# EAGLE design ME433_Collins (EAGLE 5.12)
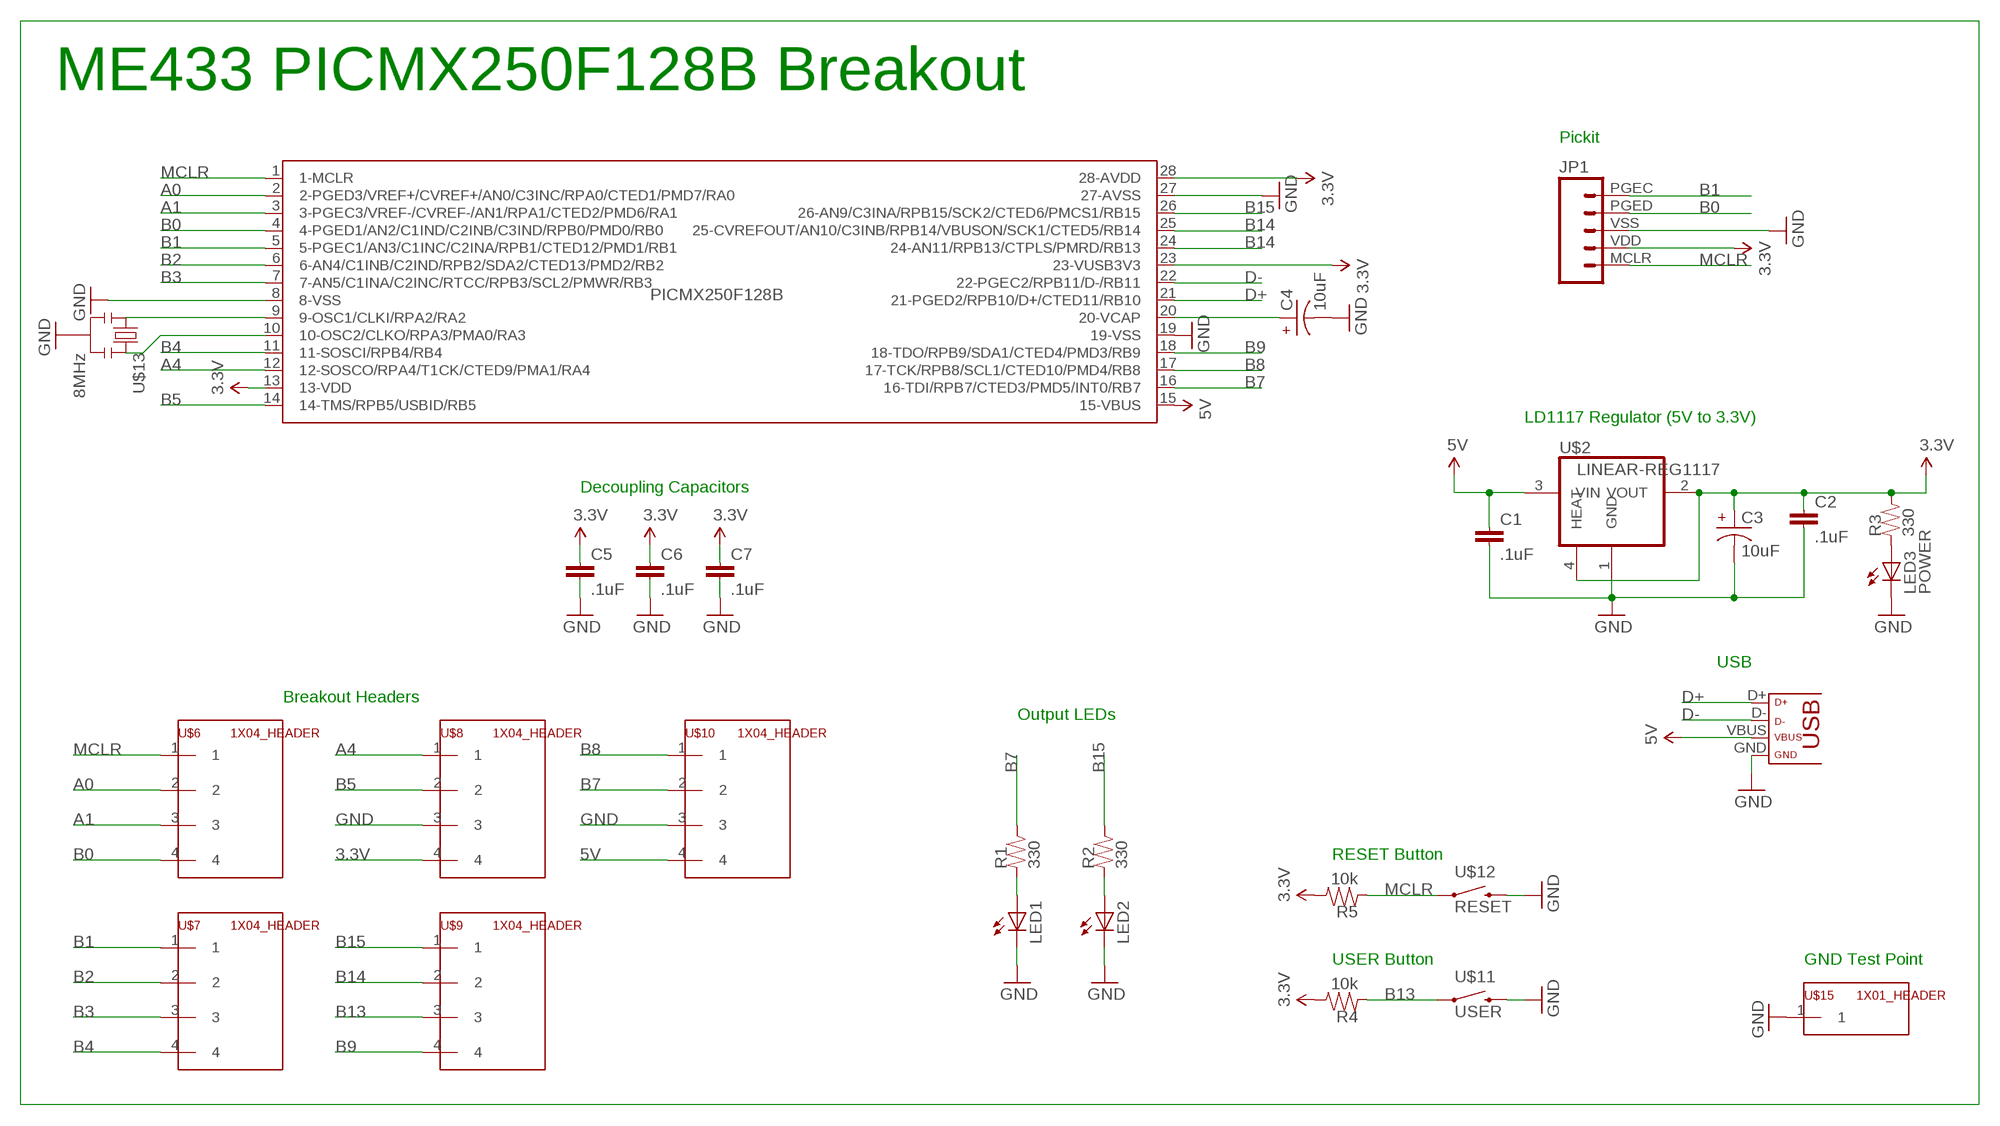
[diagram p0: schematic, sheet 1]

## Parts
C1  .1uF  CAP0603  [0603]
C2  .1uF  CAP0603  [0603]
C3  10uF  CAP-POL0603  [0603-POL]
C4  10uF  CAP-POL0603  [0603-POL]
C5  .1uF  CAP0603  [0603]
C6  .1uF  CAP0603  [0603]
C7  .1uF  CAP0603  [0603]
JP1  M05PICKIT3  [1X05-PICKIT3]
LED1  LED0603  [0603-DIODE]
LED2  LED0603  [0603-DIODE]
LED3  POWER  LED0603  [0603-DIODE]
R1  330  R0603  [0603]
R2  330  R0603  [0603]
R3  330  R0603  [0603]
R4  10k  R0603  [0603]
R5  10k  R0603  [0603]
U$1  PICMX250F128B  [DIL28-3]
U$2  LINEAR-REG1117  [SOT223]
U$4  USB  [USB-MINIB]
U$6  1X04_HEADER  [1X04]
U$7  1X04_HEADER  [1X04]
U$8  1X04_HEADER  [1X04]
U$9  1X04_HEADER  [1X04]
U$10  1X04_HEADER  [1X04]
U$11  USER  TACTILE_SWITCHPUSH  [PUSH_BUTTON]
U$12  RESET  TACTILE_SWITCHPUSH  [PUSH_BUTTON]
U$13  8MHz  RESONATOR  [RADIAL-3LEAD]
U$15  1X01_HEADER  [1X01]

## Nets
3.3V: C2.1 C3.+ C5.1 C6.1 C7.1 JP1.VDD R3.2 R4.2 R5.2 U$1.13(13-VDD) U$1.23(23-VUSB3V3) U$1.28(28-AVDD) U$2.2(VOUT) U$2.4(HEAT) U$8.4
5V: C1.1 U$1.15(15-VBUS) U$2.3(VIN) U$4.VBUS U$10.4
A0: U$1.2(2-PGED3/VREF+/CVREF+/AN0/C3INC/RPA0/CTED1/PMD7/RA0) U$6.2
A1: U$1.3(3-PGEC3/VREF-/CVREF-/AN1/RPA1/CTED2/PMD6/RA1) U$6.3
A4: U$1.12(12-SOSCO/RPA4/T1CK/CTED9/PMA1/RA4) U$8.1
B0: JP1.PGED U$1.4(4-PGED1/AN2/C1IND/C2INB/C3IND/RPB0/PMD0/RB0) U$6.4
B1: JP1.PGEC U$1.5(5-PGEC1/AN3/C1INC/C2INA/RPB1/CTED12/PMD1/RB1) U$7.1
B2: U$1.6(6-AN4/C1INB/C2IND/RPB2/SDA2/CTED13/PMD2/RB2) U$7.2
B3: U$1.7(7-AN5/C1INA/C2INC/RTCC/RPB3/SCL2/PMWR/RB3) U$7.3
B4: U$1.11(11-SOSCI/RPB4/RB4) U$7.4
B5: U$1.14(14-TMS/RPB5/USBID/RB5) U$8.2
B7: R1.2 U$1.16(16-TDI/RPB7/CTED3/PMD5/INT0/RB7) U$10.2
B8: U$1.17(17-TCK/RPB8/SCL1/CTED10/PMD4/RB8) U$10.1
B9: U$1.18(18-TDO/RPB9/SDA1/CTED4/PMD3/RB9) U$9.4
B13: R4.1 U$1.24(24-AN11/RPB13/CTPLS/PMRD/RB13) U$9.3 U$11.1
B14: U$1.25(25-CVREFOUT/AN10/C3INB/RPB14/VBUSON/SCK1/CTED5/RB14) U$9.2
B15: R2.2 U$1.26(26-AN9/C3INA/RPB15/SCK2/CTED6/PMCS1/RB15) U$9.1
D+: U$1.21(21-PGED2/RPB10/D+/CTED11/RB10) U$4.D+
D-: U$1.22(22-PGEC2/RPB11/D-/RB11) U$4.D-
GND: C1.2 C2.2 C3.- C4.- C5.2 C6.2 C7.2 JP1.VSS LED1.CAT(C) LED2.CAT(C) LED3.CAT(C) U$1.8(8-VSS) U$1.19(19-VSS) U$1.27(27-AVSS) U$2.1(GND) U$4.GND U$8.3 U$10.3 U$11.2 U$12.2 U$13.GND U$15.1
MCLR: JP1.MCLR R5.1 U$1.1(1-MCLR) U$6.1 U$12.1
N$2: LED1.AN(A) R1.1
N$3: U$1.10(10-OSC2/CLKO/RPA3/PMA0/RA3) U$13.2
N$4: U$1.9(9-OSC1/CLKI/RPA2/RA2) U$13.1
N$5: C4.+ U$1.20(20-VCAP)
N$6: LED2.AN(A) R2.1
N$8: LED3.AN(A) R3.1

## Notes on the sheet
- ME433 PICMX250F128B Breakout
- Pickit
- LD1117 Regulator (5V to 3.3V)
- Decoupling Capacitors
- USB
- Breakout Headers
- Output LEDs
- RESET Button
- USER Button | GND Test Point

## Library data of the parts
C1 C2 C5-C7 = ME433_MC:CAP: Capacitor Standard 0603 ceramic capacitor, and 0.1" leaded capacitor.
C3 C4 = ME433_MC:CAP-POL: CAPACITOR, American symbol
JP1 = ME433_MC:M05: Header 5 Standard 5-pin 0.1" header. Use with straight break away headers (SKU : PRT-00116), right angle break away headers (PRT-00553), swiss pins (PRT-00743), machine pins (PRT-00117), and female headers (PRT-00115). Molex polarized connector foot print use with SKU : PRT-08230 with associated crimp pins and housings.
LED1-LED3 = ME433_MC:LED: LEDs Standard schematic elements and footprints for 5mm, 3mm, 1206, and 0603 sized LEDs. 5mm - Spark Fun Electronics SKU : COM-00529 (and others)
R1-R5 = ME433_MC:R: RESISTOR, American symbol
U$1 = ME433_MC:PICMX250F128B
U$2 = ME433_MC:LINEAR-REG
U$4 = ME433_MC:USB
U$6-U$10 = ME433_MC:1X04_HEADER
U$11 U$12 = ME433_MC:TACTILE_SWITCH
U$13 = ME433_MC:RESONATOR
U$15 = ME433_MC:1X01_HEADER

## Board
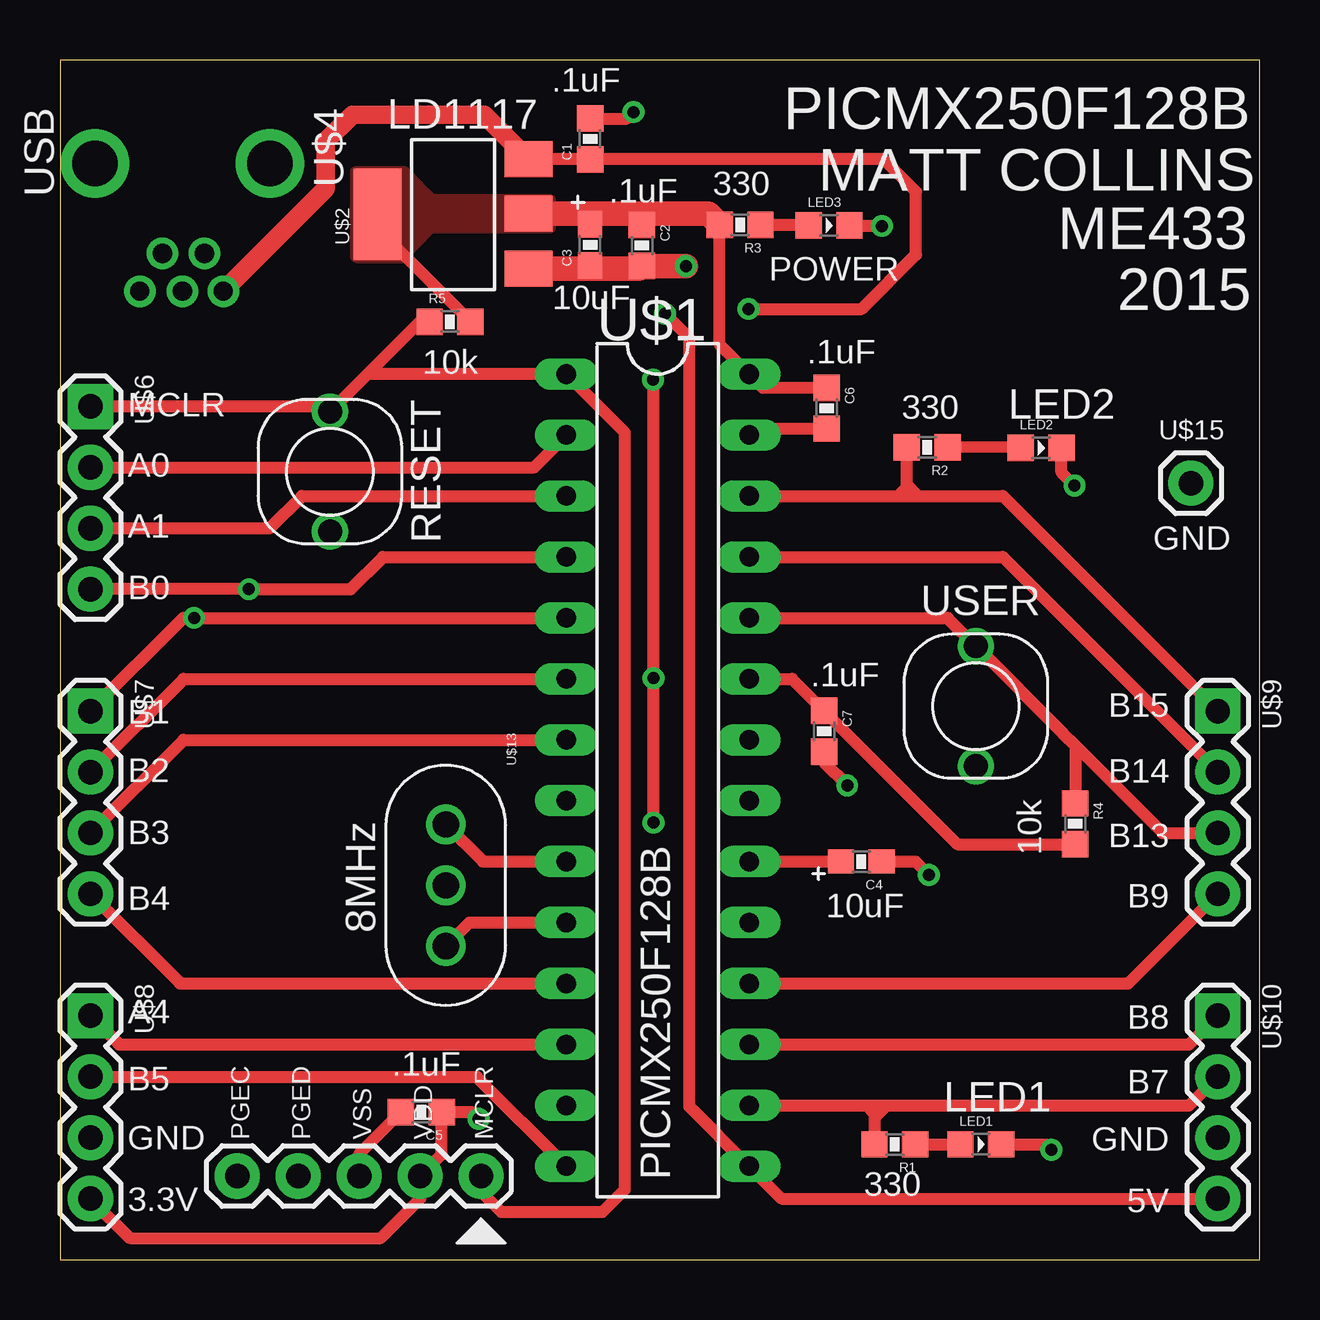
[diagram p1: board, top side]
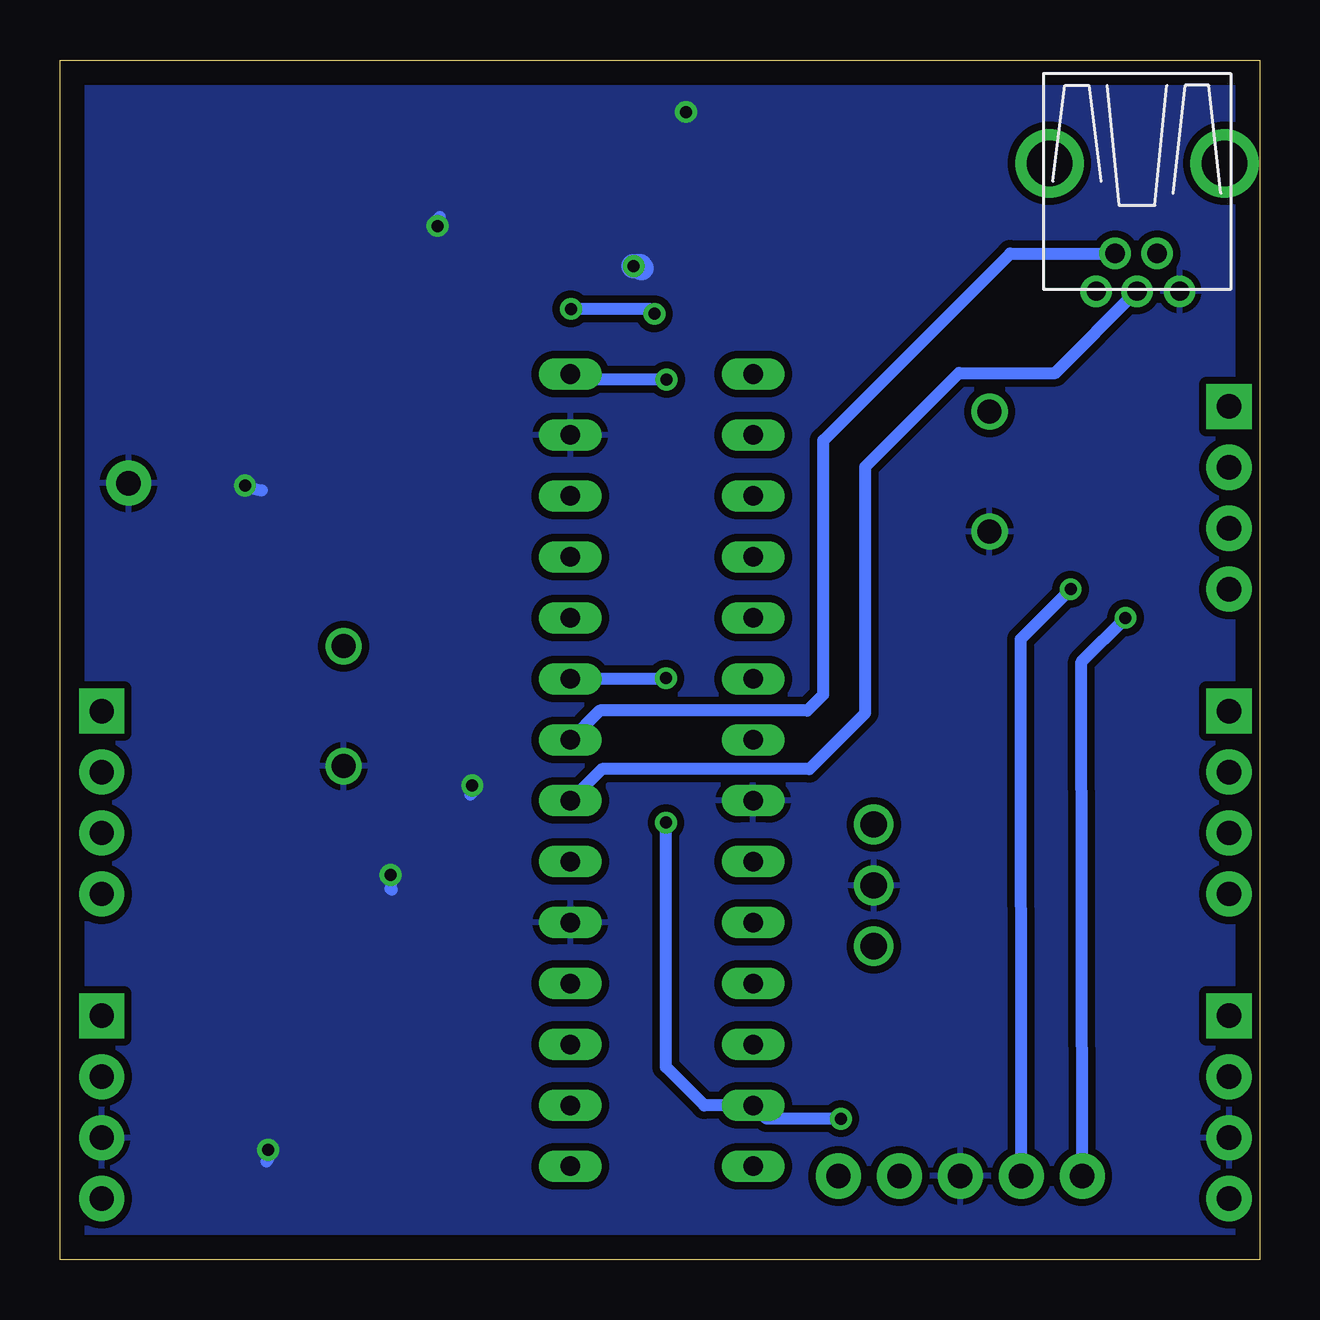
[diagram p2: board, bottom side, seen from below]

Size 50 x 50 mm. Coordinates in mm from the lower left corner, seen from the top.
Outline: 0,0 50,0 50,50 0,50 0,0
Copper layers (1*16): Top 0.035mm / dielectric 1.5mm / Bottom 0.035mm
Design rules "default": minimum track width 10mil, minimum drill 24mil, track to track 8mil, track to pad 8mil, pad to pad 8mil, via to via 8mil, smd to smd 8mil, copper to edge 40mil, drill to drill 8mil, minimum pad ring 10mil, minimum via ring 8mil, stop-mask expansion 4mil, vias tented up to drill 0mil, thermal gap 10mil

### Footprints (pad centres in the part's own frame; a part is rotated, then mirrored left to right if it is on the bottom)
0603 = smd 1.1 x 1.1: 1 -0.85,0; 2 0.85,0
0603-POL = smd 1.1 x 1: + 0.85,0; - -0.85,0
1X05-PICKIT3 = drill 1.016 pad 1.88 round: MCLR 1.27,-1.016; PGEC 11.43,-1.016; PGED 8.89,-1.016; VDD 3.81,-1.016; VSS 6.35,-1.016
0603-DIODE = smd 1.1 x 1.1: AN -0.85,0; CAT 0.85,0
DIL28-3 = drill 0.813 long: 1 -16.51,-3.81; 2 -13.97,-3.81; 3 -11.43,-3.81; 4 -8.89,-3.81; 5 -6.35,-3.81; 6 -3.81,-3.81; 7 -1.27,-3.81; 8 1.27,-3.81; 9 3.81,-3.81; 10 6.35,-3.81; 11 8.89,-3.81; 12 11.43,-3.81; 13 13.97,-3.81; 14 16.51,-3.81; 15 16.51,3.81; 16 13.97,3.81; 17 11.43,3.81; 18 8.89,3.81; 19 6.35,3.81; 20 3.81,3.81; 21 1.27,3.81; 22 -1.27,3.81; 23 -3.81,3.81; 24 -6.35,3.81; 25 -8.89,3.81; 26 -11.43,3.81; 27 -13.97,3.81; 28 -16.51,3.81
SOT223 = smd 1.499 x 2.007: 1 -2.261,-3.15; 2 0.025,-3.15; 3 2.311,-3.15 | smd 3.81 x 2.007: 4 0,3.15
USB-MINIB = drill 0.8 round: D+ 4.064,0; D- 2.489,0.914; GND 4.064,-1.778; ID 2.489,-0.838; VBUS 4.064,1.702 | drill 1.9 round: P$6 -1.27,-3.65; P$7 -1.27,3.65
1X04 = drill 1.016 pad 1.88 square: 1 0,0 | drill 1.016 pad 1.88 round: 2 2.54,0; 3 5.08,0; 4 7.62,0
PUSH_BUTTON = drill 1 round: 1 -2.5,0; 2 2.5,0
RADIAL-3LEAD = drill 1.1 round: 1 -2.54,0; 2 2.54,0; GND 0,0
1X01 = drill 1.016 pad 1.88 round: 1 0,0

### Placement (x,y rotation side)
C1  22.1,46.71 90 top
C2  24.26,42.27 270 top
C3  22.1,42.29 90 top
C4  33.4,16.59 180 top
C5  15.06,6.15 180 top
C6  31.95,35.48 270 top
C7  31.85,22.02 270 top
JP1  18.82,2.46 180 top
LED1  38.38,4.8 0 top
LED2  40.89,33.83 0 top
LED3  32.05,43.1 0 top
R1  34.8,4.8 180 top
R2  36.14,33.86 180 top
R3  28.35,43.13 180 top
R4  42.32,18.16 270 top
R5  16.26,39.09 0 top
U$1  24.92,20.4 270 top
U$2  16.38,43.56 90 top
U$4  5.11,44.42 270 top
U$6  1.27,35.56 270 top
U$7  1.27,22.86 270 top
U$8  1.27,10.16 270 top
U$9  48.26,22.86 270 top
U$10  48.26,10.16 270 top
U$11  38.18,23.06 270 top
U$12  11.25,32.84 270 top
U$13  16.08,15.6 270 top
U$15  47.14,32.36 0 top

### Tracks (layer width: path | path; a pad name or v marks a point on that pad's centre or on a via)
3.3V  (via drill 0.5)
  Top 0.508: U$8.4 2.92,0.89 13.36,0.89 15.01,2.54 JP1.VDD 15.91,4.38 C5.1 17.17,6.15 v17.45,5.87 | R3.2 27.5,38.14 U$1.28 29.3,36.33 C6.1 | R4.2 37.41,17.31 C7.1 30.52,24.21 U$1.23 | R5.2 13.23,42.96 U$2.4 | v24.74,18.21 v24.74,24.23 24.74,36.65 v24.71,36.68
  Top 1.016: 21.92,43.59 U$2.2 | 24.28,43.59 21.92,43.59 | 24.28,43.59 27.04,43.59 R3.2 | C3.+ 22.1,43.41 21.92,43.59 | C2.1 24.26,43.56 24.28,43.59
  Bottom 0.508: v24.74,18.21 24.74,8.03 23.14,6.43 U$1.13 20.55,5.87 v17.45,5.87 | v24.71,36.68 28.5,36.68 U$1.28 | U$1.23 24.77,24.21 v24.74,24.23
  pour Top (no thermals): 13,41.66 14.27,41.66 14.91,42.29 15.52,42.9 19.53,42.9 20.42,42.9 arc90 20.55,43.03 20.55,44.15 arc90 20.42,44.27 15.57,44.27 15.01,44.83 14.4,45.44 13,45.44 12.34,45.44 arc90 12.19,45.29 12.19,41.88 arc90 12.42,41.66
5V  (via drill 0.5)
  Top 0.508: U$2.3 22.09,45.87 C1.1 34.33,45.86 35.69,44.5 35.69,41.88 33.43,39.62 v28.7,39.62 | U$10.4 30.07,2.54 U$1.15 26.24,6.38 26.24,38.41 v25.22,39.42
  Top 0.762: U$4.VBUS 11.07,44.63 11.07,46.61 12.19,47.73 17.68,47.73 U$2.3
  Bottom 0.508: v28.7,39.62 25.43,39.62 v25.22,39.42
A0
  Top 0.508: U$1.2 19.76,33.02 U$6.2
A1
  Top 0.508: U$1.3 10.08,31.83 8.74,30.48 U$6.3
A4
  Top 0.508: U$1.12 2.46,8.97 U$8.1
B0  (via drill 0.5)
  Top 0.508: U$1.4 13.46,29.29 12.12,27.94 v7.87,27.94 U$6.4
  Bottom 0.508: JP1.PGED 9.96,25.86 v7.87,27.94
B1  (via drill 0.5)
  Top 0.508: U$1.5 v5.59,26.75 5.16,26.75 U$7.1
  Bottom 0.508: JP1.PGEC 7.42,24.92 v5.59,26.75
B2
  Top 0.508: U$1.6 5.16,24.21 U$7.2
B3
  Top 0.508: U$1.7 5.16,21.67 U$7.3
B4
  Top 0.508: U$1.11 5,11.51 U$7.4
B5
  Top 0.508: U$1.14 17.37,7.62 U$8.2
B7
  Top 0.508: U$1.16 33.6,6.43 | 33.6,6.43 34.47,6.43 | 34.47,6.43 47.07,6.43 U$10.2 | 34.47,6.43 33.95,5.91 | R1.2 33.95,6.08 33.6,6.43
B8
  Top 0.508: U$1.17 47.07,8.97 U$10.1
B9
  Top 0.508: U$1.18 44.53,11.51 U$9.4
B13
  Top 0.508: U$1.24 36.99,26.75 U$11.1 41.79,21.95 42.32,21.42 | 42.32,21.42 45.96,17.78 U$9.3 | 42.32,21.42 R4.1
B14
  Top 0.508: U$1.25 39.29,29.29 U$9.2
B15
  Top 0.508: U$1.26 34.92,31.83 | 34.92,31.83 35.76,31.83 | 35.76,31.83 39.29,31.83 U$9.1 | 34.92,31.83 35.29,32.2 | R2.2 35.29,32.3 35.76,31.83
D+
  Bottom 0.508: U$1.21 27.41,20.45 18.77,20.45 16.43,22.78 16.43,33.05 12.52,36.96 8.51,36.96 U$4.D+
D-
  Bottom 0.508: U$1.22 27.51,22.89 18.85,22.89 18.19,23.55 18.19,34.14 10.39,41.94 U$4.D-
GND  (via drill 0.5)
  Top 0.508: LED3.CAT 34.24,43.1 v34.27,43.08 | C1.2 23.63,47.56 v23.9,47.83 | C6.2 29,34.63 U$1.27 | LED1.CAT 41.1,4.8 v41.33,4.57 | LED2.CAT 41.74,32.8 v42.29,32.26 | C4.- 35.66,16.59 v36.22,16.03 | C7.2 31.85,20.73 v32.82,19.76 | C5.2 12.47,4.41 JP1.VSS
  Top 1.016: U$2.1 22.35,41.3 | 22.35,41.3 24.14,41.3 C2.2 26.07,41.42 v26.09,41.4 | C3.- 22.21,41.44 22.35,41.3
  Bottom 0.508: v34.27,43.08 34.27,43.36 34.16,43.46 | v23.9,47.83 23.82,47.75 | v41.33,4.57 41.33,4.17 41.4,4.09 | v42.29,32.26 42.47,32.26 41.58,32.05 | v36.22,16.03 36.22,15.47 36.17,15.42 | v32.82,19.76 32.82,19.46 32.89,19.38
  Bottom 1.016: v26.09,41.4 25.83,41.4 25.76,41.33
  pour Bottom (isolate 0.305): 24.13,49.53 49.53,49.53 49.53,30.48 49.53,0.38 12.67,0.38 0.23,0.38 0.23,35.64 0.23,49.53 23.88,49.53
MCLR
  Top 0.508: U$12.1 12.82,36.91 U$1.1 23.55,34.47 23.55,2.92 22.61,1.98 18.39,1.98 17.55,2.82 JP1.MCLR | U$6.1 11.03,35.56 U$12.1 | U$12.1 15,39.09 R5.1
N$2
  Top 0.508: R1.1 LED1.AN
N$3
  Top 0.508: U$1.10 17.07,14.05 U$13.2
N$4
  Top 0.508: U$1.9 17.63,16.59 U$13.1
N$5
  Top 0.508: U$1.20 C4.+
N$6
  Top 0.508: R2.1 39.99,33.88 LED2.AN
N$8
  Top 0.508: R3.1 31.18,43.13 arc-90 LED3.AN

### Text on the board
tPlace: .1uF | LD1117 | PICMX250F128B | MATT COLLINS | .1uF | 330 | ME433 | POWER | 10uF | 2015 | 10k | .1uF | MCLR | 330 | LED2 | A0 | A1 | RESET | GND | B0 | USER | .1uF | B15 | B1 | B14 | B2 | B13 | B3 | 10k | B9 | B4 | 8MHz | 10uF | B8 | A4 | .1uF | B7 | B5 | LED1 | GND | GND | PICMX250F128B | 330 | 5V | 3.3V